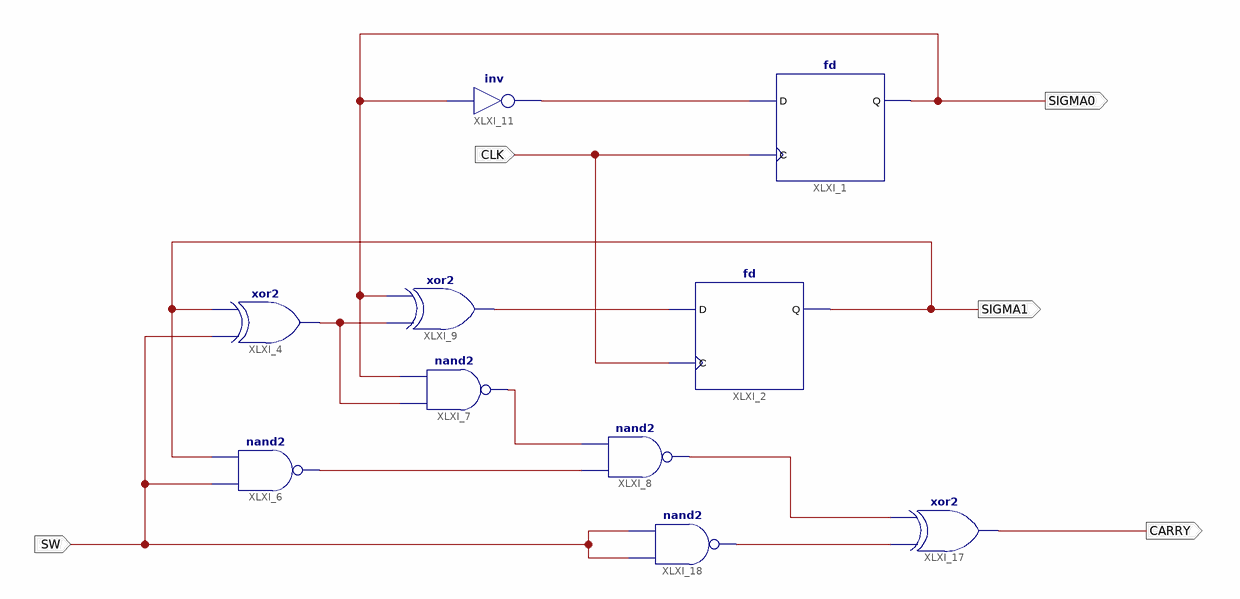
[diagram p0: schematic sheet 1]
// Xilinx ISE schematic UPDOWN_CNT2.sch (spartan6) as structural Verilog: 10 symbols, 5 ports
module UPDOWN_CNT2 (
  input  CLK,
  input  SW,
  output SIGMA0,
  output SIGMA1,
  output CARRY
);

  wire XLXN_5, XLXN_9, XLXN_23, XLXN_25, XLXN_26, XLXN_43, XLXN_58;

  fd XLXI_1 (.C(CLK), .D(XLXN_5), .Q(SIGMA0));
  fd XLXI_2 (.C(CLK), .D(XLXN_26), .Q(SIGMA1));
  xor XLXI_4 (XLXN_9, SW, SIGMA1);
  nand XLXI_6 (XLXN_25, SW, SIGMA1);
  nand XLXI_7 (XLXN_23, XLXN_9, SIGMA0);
  nand XLXI_8 (XLXN_58, XLXN_25, XLXN_23);
  xor XLXI_9 (XLXN_26, XLXN_9, SIGMA0);
  not XLXI_11 (XLXN_5, SIGMA0);
  xor XLXI_17 (CARRY, XLXN_43, XLXN_58);
  nand XLXI_18 (XLXN_43, SW, SW);
endmodule
